# EAGLE design bathroomIndicator (EAGLE 9.6.2)
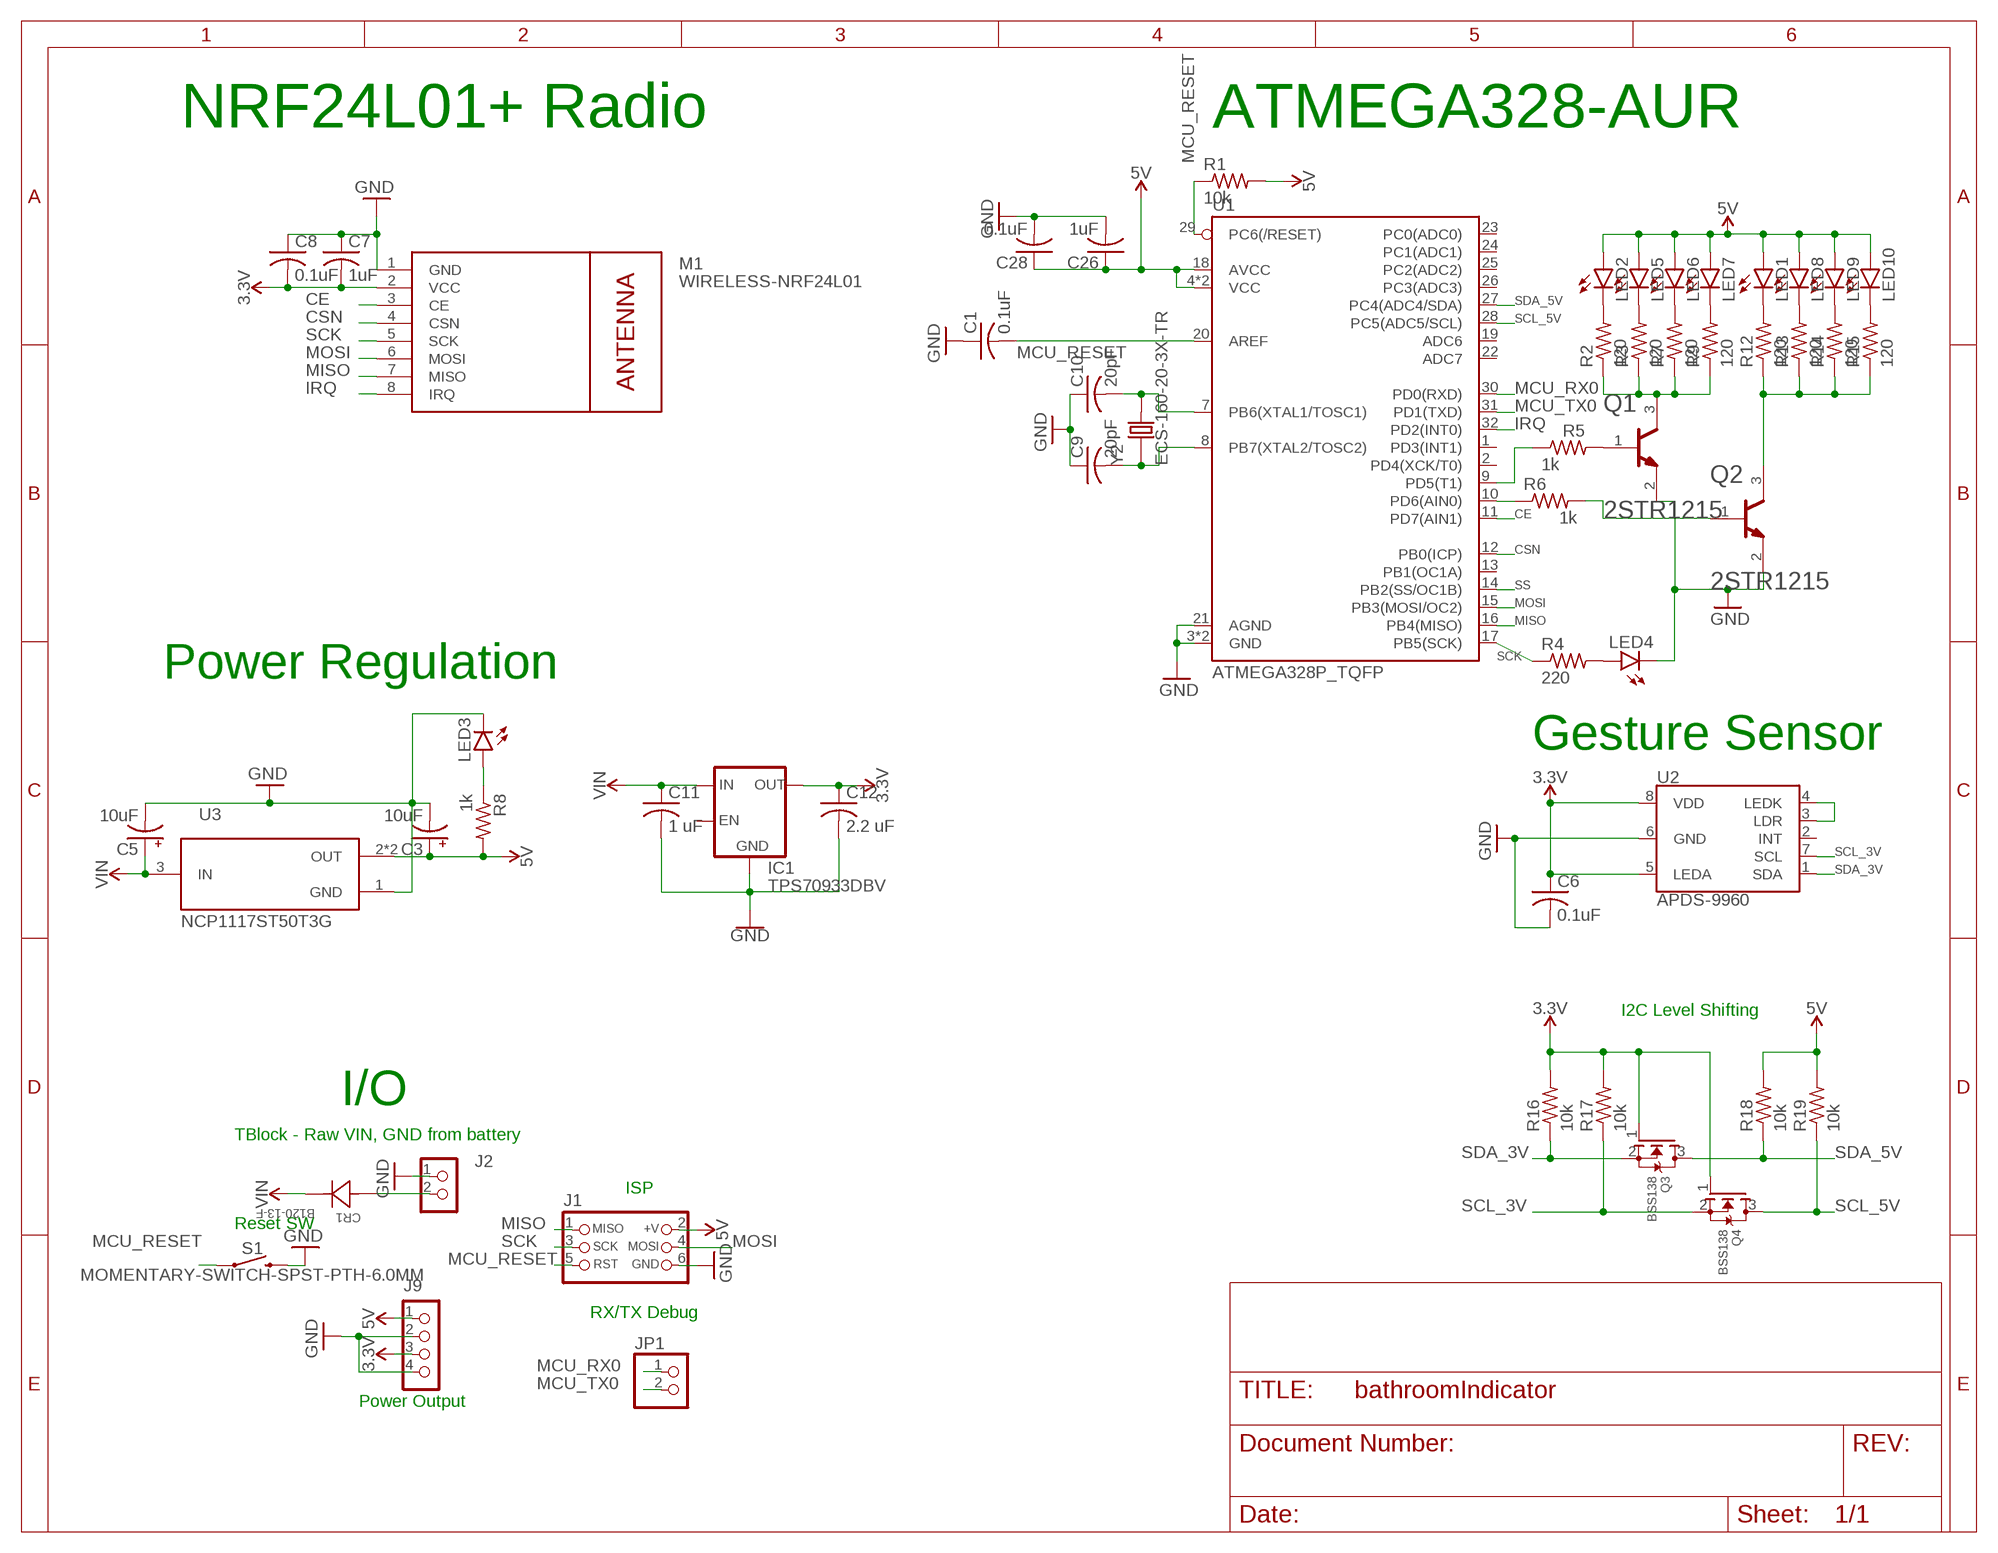
[diagram p0: schematic, sheet 1]

## Parts
C1  0.1uF  C-USC0805  [C0805]
C3  10uF  CPOL-USB/3528-21W  [B/3528-21W]
C5  10uF  CPOL-USB/3528-21W  [B/3528-21W]
C6  0.1uF  C-USC0805  [C0805]
C7  1uF  C-USC0805  [C0805]
C8  0.1uF  C-USC0805  [C0805]
C9  20pF  C-USC0805  [C0805]
C10  20pF  C-USC0805  [C0805]
C11  1 uF  C-USC0805  [C0805]
C12  2.2 uF  C-USC0805  [C0805]
C26  1uF  C-USC0805  [C0805]
C28  0.1uF  C-USC0805  [C0805]
CR1  B120-13-F  [SMA_DIO]
IC1  TPS70933DBV  [SOT23-5]
J1  CON_HEADER_PRG_AVR_ICSP-PTH  [HEADER_PRG_2X03]
J2  CON_TERMINAL_BLOCK_02-5MM  [TERMINAL_BLOCK_2P_5]
J9  CON_HEADER_1X04  [M1X4]
JP1  HEADER-1X2ROUND  [1X02_ROUND]
LED1  LED5MM  [LED5MM]
LED2  LED5MM  [LED5MM]
LED3  LEDSML0805  [SML0805]
LED4  LEDSML0805  [SML0805]
LED5  LED5MM  [LED5MM]
LED6  LED5MM  [LED5MM]
LED7  LED5MM  [LED5MM]
LED8  LED5MM  [LED5MM]
LED9  LED5MM  [LED5MM]
LED10  LED5MM  [LED5MM]
M1  WIRELESS-NRF24L01  [WIRELESS-NRF24L01]
Q1  STMICROELECTRONICS_2STR1215STMICROELECTRONICS_2STR1215_0_0  [STMICROELECTRONICS_2STR1215_0]
Q2  STMICROELECTRONICS_2STR1215STMICROELECTRONICS_2STR1215_0_0  [STMICROELECTRONICS_2STR1215_0]
Q3  BSS138  MOSFET-NWIDE  [SOT23-WIDE]
Q4  BSS138  MOSFET-NWIDE  [SOT23-WIDE]
R1  10k  R-US_R0805  [R0805]
R2  120  R-US_R0805  [R0805]
R3  120  R-US_R0805  [R0805]
R4  220  R-US_R0805  [R0805]
R5  1k  R-US_R0805  [R0805]
R6  1k  R-US_R0805  [R0805]
R7  120  R-US_R0805  [R0805]
R8  1k  R-US_R0805  [R0805]
R9  120  R-US_R0805  [R0805]
R12  120  R-US_R0805  [R0805]
R13  120  R-US_R0805  [R0805]
R14  120  R-US_R0805  [R0805]
R15  120  R-US_R0805  [R0805]
R16  10k  R-US_R0805  [R0805]
R17  10k  R-US_R0805  [R0805]
R18  10k  R-US_R0805  [R0805]
R19  10k  R-US_R0805  [R0805]
S1  MOMENTARY-SWITCH-SPST-PTH-6.0MM  [TACTILE_SWITCH_PTH_6.0MM]
U1  ATMEGA328P_TQFP  [TQFP32-08]
U2  APDS-9960  [APDS-9960]
U3  NCP1117ST50T3G  [SOT230P700X180-4N]
Y2  ECS-160-20-3X-TR  [XTAL_ECS-160-20-3X-TR]

## Nets
3.3V [ICPower]: C6.1 C7.2 C8.2 C12.1 IC1.5(OUT) J9.3 M1.2(VCC) Q3.1(G) Q4.1(G) R16.2 R17.2 U2.5(LEDA) U2.8(VDD)
5V [ICPower]: C3.+ C26.1 C28.1 J1.2(+V) J9.1 LED1.A LED2.A LED5.A LED6.A LED7.A LED8.A LED9.A LED10.A R1.2 R8.2 R18.2 R19.2 U1.4(VCC) U1.6(VCC) U1.18(AVCC) U3.2(OUT) U3.4(OUT)
CE: M1.3(CE) U1.11(PD7(AIN1))
CSN: M1.4(CSN) U1.12(PB0(ICP))
GND [ICPower]: C1.1 C3.- C5.- C6.2 C7.1 C8.1 C9.1 C10.1 C11.2 C12.2 C26.2 C28.2 IC1.2(GND) J1.6(GND) J2.1 J9.2 J9.4 LED3.C LED4.C M1.1(GND) Q1.2(E) Q2.2(E) S1.3 U1.3(GND) U1.5(GND) U1.21(AGND) U2.6(GND) U3.1(GND)
IRQ: M1.8(IRQ) U1.32(PD2(INT0))
MCU_RESET: J1.5(RST) R1.1 S1.1 U1.29(PC6(/RESET))
MCU_RX0: JP1.1 U1.30(PD0(RXD))
MCU_TX0: JP1.2 U1.31(PD1(TXD))
MISO: J1.1(MISO) M1.7(MISO) U1.16(PB4(MISO))
MOSI: J1.4(MOSI) M1.6(MOSI) U1.15(PB3(MOSI/OC2))
N$2 [ICPower]: LED2.K(C) R2.2
N$3 [ICPower]: LED5.K(C) R3.2
N$4: C1.2 U1.20(AREF)
N$5 [ICPower]: LED6.K(C) R7.2
N$6: R5.1 U1.9(PD5(T1))
N$7 [ICPower]: LED7.K(C) R9.2
N$8: LED4.A R4.2
N$10: Q2.1(B) R6.2
N$11: R6.1 U1.10(PD6(AIN0))
N$12: LED3.A R8.1
N$13: Q1.1(B) R5.2
N$14: C9.2 U1.8(PB7(XTAL2/TOSC2)) Y2.1
N$15: C10.2 U1.7(PB6(XTAL1/TOSC1)) Y2.2
N$24: U2.3(LDR) U2.4(LEDK)
N$26 [ICPower]: LED1.K(C) R12.2
N$27 [ICPower]: LED8.K(C) R13.2
N$28 [ICPower]: LED9.K(C) R14.2
N$29 [ICPower]: LED10.K(C) R15.2
N$30 [ICPower]: Q1.3(C) R2.1 R3.1 R7.1 R9.1
N$31 [ICPower]: Q2.3(C) R12.1 R13.1 R14.1 R15.1
N$33 [HighPower]: CR1.2 J2.2
SCK: J1.3(SCK) M1.5(SCK) R4.1 U1.17(PB5(SCK))
SCL_3V: Q4.2(S) R17.1 U2.7(SCL)
SCL_5V: Q4.3(D) R19.1 U1.28(PC5(ADC5/SCL))
SDA_3V: Q3.2(S) R16.1 U2.1(SDA)
SDA_5V: Q3.3(D) R18.1 U1.27(PC4(ADC4/SDA))
SS: U1.14(PB2(SS/OC1B))
VIN [ICPower]: C5.+ C11.1 CR1.1 IC1.1(IN) U3.3(IN)
Unconnected: IC1.3(EN) U1.1(PD3(INT1)) U1.2(PD4(XCK/T0)) U1.13(PB1(OC1A)) U1.19(ADC6) U1.22(ADC7) U1.23(PC0(ADC0)) U1.24(PC1(ADC1)) U1.25(PC2(ADC2)) U1.26(PC3(ADC3)) U2.2(INT)

## Notes on the sheet
- NRF24L01+ Radio | ATMEGA328-AUR
- Power Regulation
- Gesture Sensor
- I2C Level Shifting
- I/O
- TBlock - Raw VIN, GND from battery
- ISP
- Reset SW
- RX/TX Debug
- Power Output

## Library data of the parts
C1 C6-C12 C26 C28 = rcl:C-US: CAPACITOR, American symbol; SPICEPREFIX: C
C3 C5 = rcl:CPOL-US: POLARIZED CAPACITOR, American symbol; SPICEPREFIX: C
CR1 = B120-13-F:B120-13-F; BUILT_BY: EMA_UL_Team; MANUFACTURER_PART_NUMBER: B120-13-F; SOURCELIBRARY: DiodesInc_2015-05-08; VENDOR: Diodes Inc
IC1 = tps709xx_10:TPS709*: TPS709xx 150-mA, 30-V, 1-μA IQ Voltage Regulators with Enable Source: http://www.ti.com/lit/ds/symlink/tps709.pdf; MF: Texas Instruments; MPN: TPS70933DBVT; OC_FARNELL: 2382995; OC_NEWARK: 37X8895
J1 = dp_devices.v6:CON_HEADER_PRG_AVR_ICSP: 2x3 AVR ICSP programming header
J2 = dp_devices.v6:CON_TERMINAL_BLOCK_02: 2 poles wire to board terminal block
J9 = dp_devices.v6:CON_HEADER_1X04
JP1 = microbuilder:HEADER-1X2: PIN HEADER
LED1-LED10 = led:LED: LED OSRAM: - CHIPLED LG R971, LG N971, LY N971, LG Q971, LY Q971, LO R971, LY R971 LH N974, LH R974 LS Q976, LO Q976, LY Q976 LO Q996 - Hyper CHIPLED LW Q18S LB Q993, LB Q99A, LB R99A - SideLED LS A670, LO A670, LY A670, LG A670, LP A670 LB A673, LV A673, LT A673, LW A673 LH A674 LY A675 LS A676, LA A676, LO A676, LY A676, LW A676 LS A679, LY A679, LG A679 - Hyper Micro SIDELED® LS Y876, LA Y876, LO Y876, LY Y876 LT Y87S - SmartLED LW L88C, LW L88S LB L89C, LB L89S, LG L890 LS L89K, LO L89K, LY L89K LS L896, LA L896, LO L896, LY L896 - TOPLED LS T670, LO T670, LY T670, LG T670, LP T670 LSG T670, LSP T670, LSY T670, LOP T670, LYG T670 LG T671, LOG T671, LSG T671 LB T673, LV T673, LT T673, LW T673 LH T674 LS T676, LA T676, LO T676, LY T676, LB T676, LH T676, LSB T676, LW T676 LB T67C, LV T67C, LT T67C, LS T67K, LO T67K, LY T67K, LW E67C LS E67B, LA E67B, LO E67B, LY E67B, LB E67C, LV E67C, LT E67C LW T67C LS T679, LY T679, LG T679 LS T770, LO T770, LY T770, LG T770, LP T770 LB T773, LV T773, LT T773, LW T773 LH T774 LS E675, LA E675, LY E675, LS T675 LS T776, LA T776, LO T776, LY T776, LB T776 LHGB T686 LT T68C, LB T68C - Hyper Mini TOPLED® LB M676 - Mini TOPLED Santana® LG M470 LS M47K, LO M47K, LY M47K Source: http://www.osram.convergy.de LUXEON: - LUMILED® LXK2-PW12-R00, LXK2-PW12-S00, LXK2-PW14-U00, LXK2-PW14-V00 LXK2-PM12-R00, LXK2-PM12-S00, LXK2-PM14-U00 LXK2-PE12-Q00, LXK2-PE12-R00, LXK2-PE12-S00, LXK2-PE14-T00, LXK2-PE14-U00 LXK2-PB12-K00, LXK2-PB12-L00, LXK2-PB12-M00, LXK2-PB14-N00, LXK2-PB14-P00, LXK2-PB14-Q00 LXK2-PR12-L00, LXK2-PR12-M00, LXK2-PR14-Q00, LXK2-PR14-R00 LXK2-PD12-Q00, LXK2-PD12-R00, LXK2-PD12-S00 LXK2-PH12-R00, LXK2-PH12-S00 LXK2-PL12-P00, LXK2-PL12-Q00, LXK2-PL12-R00 Source: www.luxeon.com KINGBRIGHT: KA-3528ASYC Source: www.kingbright.com
M1 = diy-modules:WIRELESS-NRF24L01: 2.4 GHz Wireless Module based on NRF24L01 chip More details available here: http://www.electrodragon.com/w/NRF24L01 Click here to find device on ebay.com <http://www.ebay.com/sch/nrf24l01+arduino>
Q1 Q2 = STMicroelectronics - 2STR1215:STMICROELECTRONICS_2STR1215: Bipolar (BJT) Transistor NPN 15V 1.5A 500mW Surface Mount SOT-23-3; AUTOMOTIVE: No; CENTROID_NOT_SPECIFIED: No; COLLECTOR_BASE_VOLTAGE: 15V; COLLECTOR_EMITTER_BREAKDOWN_VOLTAGE: 15V; COLLECTOR_EMITTER_SATURATION_VOLTAGE: 0.4V; COLLECTOR_EMITTER_VOLTAGE: 15V; DATASHEET: https://www.st.com/resource/en/datasheet/2str1215.pdf; DEVICE_CLASS_L1: Discrete Semiconductors; DEVICE_CLASS_L2: Transistors; DEVICE_CLASS_L3: BJTs; DIGIKEY_DESCRIPTION: TRANS NPN 15V 1.5A SOT-23; DIGIKEY_PART_NUMBER: 497-6205-1-ND; EMITTER_BASE_VOLTAGE: 5V; FOOTPRINT_PARAMETERS_1: {"fp_type":"SOT23","params":{"N":{"default":"3","long name":"Number of leads","type":"multichoice","short name":"N"},"A":{"nom":false,"long name":"Height","min":false,"max":1250000,"short name":"A","type":"measurement"},"A1":{"nom":75000,"long name":"Package clearance","min":0,"max":150000,"short name":"A1","type":"measurement"},"A2":{"nom":1100000,"long name":"Package height","min":1000000,"max":1200000,"short name":"A2","type":"measurement"},"D":{"nom":2926000,"long name":"Package length","min":2826000,"max":3026000,"short name":"D","type":"measurement"},"E":{"nom":2800000,"long name":"Width /w leads","min":2600000,"max":3000000,"short name":"E","type":"measurement"},"E1":{"nom":1625000,"long name":"Package width","min":1526000,"max":1726000,"short name":"E1","type":"measurement"},"B":{"nom":430000,"long name":"Lead width","min":360000,"max":500000,"short name":"B","type":"measurement"},"C":{"nom":170000,"long name":"Lead thickness","min":140000,"max":200000,"short name":"C","type":"measurement"},"L":{"nom":450000,"long name":"Lead foot length","min":350000,"max":600000,"short name":"L","type":"measurement"},"e":{"nom":950000,"long name":"Lead pitch","min":null,"max":null,"short name":"e","type":"measurement"},"PHI":{"nom":false,"long name":"Lead angle","min":0,"max":8000000,"short name":"PHI","type":"measurement"},"offset x":{"nom":0,"long name":"X Center offset","min":null,"max":null,"short name":"offset x","type":"measurement"},"offset y":{"nom":0,"long name":"Y Center offset","min":null,"max":null,"short name":"offset y","type":"measurement"},"LS":{"default":"Rounded rectangle","long name":"Land shape","type":"multichoice","short name":"LS"},"LS1":{"default":"Rectangle","long name":"Land shape (Pin 1)","type":"multichoice","short name":"LS1"},"solder toe":{"nom":550000,"long name":"Solder fillet (toe)","min":null,"max":null,"short name":"solder toe","type":"fixedmeasurement"},"solder heel":{"nom":450000,"long name":"Solder fillet (heel)","min":null,"max":null,"short name":"solder heel","type":"fixedmeasurement"},"solder side":{"nom":50000,"long name":"Solder fillet (side)","min":null,"max":null,"short name":"solder side","type":"fixedmeasurement"},"courtyard":{"nom":500000,"long name":"Courtyard","min":null,"max":null,"short name":"courtyard","type":"fixedmeasurement"},"SF":{"default":"A","long name":"Packing level","type":"multichoiceparent","short name":"SF","help":"http://support.upverter.com/customer/portal/articles/978783-what-is-a-footprint-packing-level","children":["solder toe","solder heel","solder side","courtyard"]}}}; FOOTPRINT_PARAMETERS_2: {"fp_type":"SOT23","params":{"N":{"default":"3","long name":"Number of leads","type":"multichoice","short name":"N"},"A":{"nom":false,"long name":"Height","min":false,"max":1250000,"short name":"A","type":"measurement"},"A1":{"nom":75000,"long name":"Package clearance","min":0,"max":150000,"short name":"A1","type":"measurement"},"A2":{"nom":1100000,"long name":"Package height","min":1000000,"max":1200000,"short name":"A2","type":"measurement"},"D":{"nom":2926000,"long name":"Package length","min":2826000,"max":3026000,"short name":"D","type":"measurement"},"E":{"nom":2800000,"long name":"Width /w leads","min":2600000,"max":3000000,"short name":"E","type":"measurement"},"E1":{"nom":1625000,"long name":"Package width","min":1526000,"max":1726000,"short name":"E1","type":"measurement"},"B":{"nom":430000,"long name":"Lead width","min":360000,"max":500000,"short name":"B","type":"measurement"},"C":{"nom":170000,"long name":"Lead thickness","min":140000,"max":200000,"short name":"C","type":"measurement"},"L":{"nom":450000,"long name":"Lead foot length","min":350000,"max":600000,"short name":"L","type":"measurement"},"e":{"nom":950000,"long name":"Lead pitch","min":null,"max":null,"short name":"e","type":"measurement"},"PHI":{"nom":false,"long name":"Lead angle","min":0,"max":8000000,"short name":"PHI","type":"measurement"},"offset x":{"nom":0,"long name":"X Center offset","min":null,"max":null,"short name":"offset x","type":"measurement"},"offset y":{"nom":0,"long name":"Y Center offset","min":null,"max":null,"short name":"offset y","type":"measurement"},"LS":{"default":"Rounded rectangle","long name":"Land shape","type":"multichoice","short name":"LS"},"LS1":{"default":"Rectangle","long name":"Land shape (Pin 1)","type":"multichoice","short name":"LS1"},"solder toe":{"nom":350000,"long name":"Solder fillet (toe)","min":null,"max":null,"short name":"solder toe","type":"fixedmeasurement"},"solder heel":{"nom":350000,"long name":"Solder fillet (heel)","min":null,"max":null,"short name":"solder heel","type":"fixedmeasurement"},"solder side":{"nom":30000,"long name":"Solder fillet (side)","min":null,"max":null,"short name":"solder side","type":"fixedmeasurement"},"courtyard":{"nom":250000,"long name":"Courtyard","min":null,"max":null,"short name":"courtyard","type":"fixedmeasurement"},"SF":{"default":"B","long name":"Packing level","type":"multichoiceparent","short name":"SF","help":"http://support.upverter.com/customer/portal/articles/978783-what-is-a-footprint-packing-level","children":["solder toe","solder heel","solder side","courtyard"]}}}; FOOTPRINT_PARAMETERS_3: {"fp_type":"SOT23","params":{"N":{"default":"3","long name":"Number of leads","type":"multichoice","short name":"N"},"A":{"nom":false,"long name":"Height","min":false,"max":1250000,"short name":"A","type":"measurement"},"A1":{"nom":75000,"long name":"Package clearance","min":0,"max":150000,"short name":"A1","type":"measurement"},"A2":{"nom":1100000,"long name":"Package height","min":1000000,"max":1200000,"short name":"A2","type":"measurement"},"D":{"nom":2926000,"long name":"Package length","min":2826000,"max":3026000,"short name":"D","type":"measurement"},"E":{"nom":2800000,"long name":"Width /w leads","min":2600000,"max":3000000,"short name":"E","type":"measurement"},"E1":{"nom":1625000,"long name":"Package width","min":1526000,"max":1726000,"short name":"E1","type":"measurement"},"B":{"nom":430000,"long name":"Lead width","min":360000,"max":500000,"short name":"B","type":"measurement"},"C":{"nom":170000,"long name":"Lead thickness","min":140000,"max":200000,"short name":"C","type":"measurement"},"L":{"nom":450000,"long name":"Lead foot length","min":350000,"max":600000,"short name":"L","type":"measurement"},"e":{"nom":950000,"long name":"Lead pitch","min":null,"max":null,"short name":"e","type":"measurement"},"PHI":{"nom":false,"long name":"Lead angle","min":0,"max":8000000,"short name":"PHI","type":"measurement"},"offset x":{"nom":0,"long name":"X Center offset","min":null,"max":null,"short name":"offset x","type":"measurement"},"offset y":{"nom":0,"long name":"Y Center offset","min":null,"max":null,"short name":"offset y","type":"measurement"},"LS":{"default":"Rounded rectangle","long name":"Land shape","type":"multichoice","short name":"LS"},"LS1":{"default":"Rectangle","long name":"Land shape (Pin 1)","type":"multichoice","short name":"LS1"},"solder toe":{"nom":150000,"long name":"Solder fillet (toe)","min":null,"max":null,"short name":"solder toe","type":"fixedmeasurement"},"solder heel":{"nom":250000,"long name":"Solder fillet (heel)","min":null,"max":null,"short name":"solder heel","type":"fixedmeasurement"},"solder side":{"nom":10000,"long name":"Solder fillet (side)","min":null,"max":null,"short name":"solder side","type":"fixedmeasurement"},"courtyard":{"nom":100000,"long name":"Courtyard","min":null,"max":null,"short name":"courtyard","type":"fixedmeasurement"},"SF":{"default":"C","long name":"Packing level","type":"multichoiceparent","short name":"SF","help":"http://support.upverter.com/customer/portal/articles/978783-what-is-a-footprint-packing-level","children":["solder toe","solder heel","solder side","courtyard"]}}}; FOOTPRINT_VARIANT_NAME_0: Recommended_Land_Pattern; FOOTPRINT_VARIANT_NAME_1: IPC_A; FOOTPRINT_VARIANT_NAME_2: IPC_B; FOOTPRINT_VARIANT_NAME_3: IPC_C; HEIGHT: 1.25mm; HFE_MAX: 560; HFE_MIN: 200; HFE_TESTIC: 0.5A; HFE_TESTVCE: 2V; IPC_LAND_PATTERN_NAME: SOT95P280X125-3; LEAD_FREE: Yes; MAX_COLLECTOR_CURRENT: 1.5A; MAX_JUNCTION_TEMP: +150°C; MF: STMicroelectronics; MFG_PACKAGE_IDENT: SOT23_8162275; MFG_PACKAGE_IDENT_COMPONENT_ID: 8e1c602943959e66; MFG_PACKAGE_IDENT_DATE: 0; MFG_PACKAGE_IDENT_REV: 3; MOUSER_DESCRIPTION: Bipolar Transistors - BJT Lo Vltg FAST SWITCH Hi GAIN PNP; MOUSER_PART_NUMBER: 511-2STR1215; MPN: 2STR1215; NUMBER_OF_ELEMENTS: 1; NUMBER_OF_NPN: 1; PACKAGE: SOT-23; POWER_DISSIPATION: 0.5W; PREFIX: Q; ROHS: Yes; RTHJA_MAX: 250°C/W; STANDOFF_HEIGHT: 0mm; TEMPERATURE_RANGE_HIGH: +150°C; TEMPERATURE_RANGE_LOW: -65°C; VERIFICATION_VERSION: 0.0.0.3; VOLTAGE: 15V
Q3 Q4 = microbuilder:MOSFET-N: N-Channel Mosfet LEGEND VDS: Voltage Drain-Source ID: Drain Current RDS(ON): Drain-Source On-State Resistance VGS(TH): Gate-Source Threshold Voltage CISS: Drain-Source Input Capacitance SOT-23 Name VDS ID RDS(ON) VGS(TH) CISS Order Number 2N7002E 60V 260mA 2.5 Ohm 2.5V @ 250uA 26.7pF @ 25V 2N7002ET1GOSTR-ND BSH103 30V 850mA 400 mOhm 400mV @ 1mA 83pF @ 24V BSH103,235-ND BSS138 60V 320mA 1.6 Ohm 1.5V @ 250uA 50pF @ 10V Mouser: 771-BSS138PW115 DMN2075U-7 20V 4.2A 38 mOhm 1V @ 250 uA 594.3pF @ 10V DMN2075U-7DICT-ND * BSS138 good choice for I2C level-shifting
R1-R9 R12-R19 = rcl:R-US_: RESISTOR, American symbol; SPICEPREFIX: R
S1 = SparkFun-Switches:MOMENTARY-SWITCH-SPST: Momentary Switch (Pushbutton) - SPST Normally-open (NO) SPST momentary switches (buttons, pushbuttons). Variants PTH-12MM - 12mm square, through-hole Momentary Pushbutton Switch - 12mm Square <https://www.sparkfun.com/products/9190> (COM-09190) PTH-6.0MM, PTH-6.0MM-KIT - 6.0mm square, through-hole Mini Pushbutton Switch <https://www.sparkfun.com/products/97> (COM-00097) KIT package intended for soldering kit's - only one side of pads' copper is exposed. PTH-RIGHT-ANGLE-KIT - Right-angle, through-hole Right Angle Tactile Button <https://www.sparkfun.com/products/10791> - Used on SparkFun BigTime Watch Kit <https://www.sparkfun.com/products/11734> SMD-12MM - 12mm square, surface-mount Tactile Button - SMD (12mm) <https://www.sparkfun.com/products/12993> (COM-12993) Used on SparkFun PicoBoard <https://www.sparkfun.com/products/11888> SMD-4.5MM - 4.5mm Square Trackball Switch Used on SparkFun Blackberry Trackballer Breakout <https://www.sparkfun.com/products/13169> SMD-4.6MMX2.8MM - 4.60mm x 2.80mm, surface mount Used on SparkFun SAMD21 Mini Breakout <https://www.sparkfun.com/products/13664> SMD-5.2MM, SMD-5.2-REDUNDANT - 5.2mm square, surface-mount Mini Pushbutton Switch - SMD <https://www.sparkfun.com/products/8720> (COM-08720) Used on Arduino Pro Mini <https://www.sparkfun.com/products/11114> REDUNDANT package connects both switch circuits together SMD-6.0X3.5MM - 6.0 x 3.5mm, surface mount Momentary Reset Switch SMD <https://www.sparkfun.com/products/8229> (COM-08229) SMD-6.2MM-TALL - 6.2mm square, surface mount Tactile Button - SMD (6mm) <https://www.sparkfun.com/products/12992> Used on SparkFun Digital Sandbox <https://www.sparkfun.com/products/12651> SMD-RIGHT-ANGLE - Right-angle, surface mount Used on SparkFun Block for Intel® Edison - Arduino <https://www.sparkfun.com/products/13036>; PROD_ID: SWCH-08441; SF_SKU: COM-00097
U1 = SparkFun-IC-Microcontroller:ATMEGA328P_TQFP: Popular 328P in QFP Storefront component: ATmega328 - TQFP <https://www.sparkfun.com/products/13448> (COM-13448) Datasheet <http://www.sparkfun.com/datasheets/Components/SMD/ATMega328.pdf> SparkFun Products SparkFun RedBoard - Programmed with Arduino <https://www.sparkfun.com/products/12757> (DEV-12757) Arduino Pro Mini 328 - 5V/16MHz <https://www.sparkfun.com/products/11113> (DEV-11113) Arduino Pro Mini 328 - 3.3V/8MHz <https://www.sparkfun.com/products/11114> (DEV-11114) SparkFun OpenLog <https://www.sparkfun.com/products/13712> (DEV-13712) SparkFun MicroView - OLED Arduino Module <https://www.sparkfun.com/products/12923> (DEV-12923) SparkFun Digital Sandbox <https://www.sparkfun.com/products/12651> (DEV-12651) SparkFun PicoBoard <https://www.sparkfun.com/products/11888> (WIG-11888) Arduino Fio <https://www.sparkfun.com/products/10116> (DEV-10116) LilyPad Arduino 328 Main Board <https://www.sparkfun.com/products/13342> (DEV-13342) SparkFun RedStick <https://www.sparkfun.com/products/13741> (DEV-13741) LilyPad MP3 <https://www.sparkfun.com/products/11013> (DEV-11013) LilyPad Arduino SimpleSnap <https://www.sparkfun.com/products/10941> (DEV-10941) SparkFun Stepoko <https://www.sparkfun.com/products/13899> (ROB-13899) SparkFun Geiger Counter <https://www.sparkfun.com/products/11345> (SEN-11345) SparkFun EL Sequencer <https://www.sparkfun.com/products/12781> (COM-12781) Arduino Pro 328 - 5V/16MHz <https://www.sparkfun.com/products/10915> (DEV-10915) CryptoCape <https://www.sparkfun.com/products/12773> (DEV-12773) SparkFun IR Thermometer Evaluation Board - MLX90614 <https://www.sparkfun.com/products/10740> (SEN-10740) SparkFun RedBot Mainboard <https://www.sparkfun.com/products/12097> (ROB-12097) Arduino Pro 328 - 3.3V/8MHz <https://www.sparkfun.com/products/10914> (DEV-10914) SparkFun Block for Intel® Edison - Arduino <https://www.sparkfun.com/products/13036> (DEV-13036) SparkFun Simon Says - Surface Mount Soldering Kit <https://www.sparkfun.com/products/10935> (KIT-10935) SparkFun 7-Segment Serial Display - Red <https://www.sparkfun.com/products/11441> (COM-11441) SparkFun 7-Segment Serial Display - White <https://www.sparkfun.com/products/11629> (COM-11629) SparkFun 7-Segment Serial Display - Yellow <https://www.sparkfun.com/products/11443> (COM-11443) SparkFun 7-Segment Serial Display - Kelly Green <https://www.sparkfun.com/products/11440> (COM-11440) SparkFun 7-Segment Serial Display - Blue <https://www.sparkfun.com/products/11442> (COM-11442) SparkFun OpenSegment Serial Display - 20mm (Blue) <https://www.sparkfun.com/products/11647> (COM-11647) SparkFun OpenSegment Serial Display - 20mm (Green) <https://www.sparkfun.com/products/11646> (COM-11646) SparkFun OpenSegment Serial Display - 20mm (White) <https://www.sparkfun.com/products/11648> (COM-11648) SparkFun OpenSegment Serial Display - 20mm (Red) <https://www.sparkfun.com/products/11644> (COM-11644) SparkFun OpenSegment Serial Display - 20mm (Yellow) <https://www.sparkfun.com/products/11645> (COM-11645) SparkFun OpenSegment Shield <https://www.sparkfun.com/products/13190> (DEV-13190); PROD_ID: IC-09069
U2 = SparkFun-Sensors:APDS-9960: Avago APDS-9960 Digital Proximity, Ambient Light, RGB, and Gesture Sensor. The APDS-9960 offers ambient light and color measuring, proximity detection, and touchless gesture sensing. It features UV and IR blocking filters, four separate diodes sensitive to different directions, and an I2C compatible interface. Datasheet <https://cdn.sparkfun.com/datasheets/Sensors/Proximity/apds9960.pdf> SparkFun Products SparkFun RGB and Gesture Sensor - APDS-9960 <https://www.sparkfun.com/products/12787> (SEN-12787); PROD_ID: SEN-12005
U3 = NCP1117ST50T3G:NCP1117ST50T3G: 1.0 A Low-Dropout Positive ,Fixed and Adjustable,Voltage Regulators; AVAILABILITY: Unavailable; DESCRIPTION: Linear Voltage Regulator IC 1 Output 1A SOT-223; DIGIKEY-PURCHASE-URL: https://snapeda.com/shop?store=DigiKey&id=836318; MF: ON Semiconductor; MOUSER-PURCHASE-URL: https://snapeda.com/shop?store=Mouser&id=836318; MP: NCP1117ST50T3G; PACKAGE: SOT-223 ON Semiconductor; PRICE: None
Y2 = ECS-160-20-3X-TR:ECS-160-20-3X-TR: SMD QUARTZ CRYSTAL; ARROW_ELECTRONICS-PURCHASE-URL: https://snapeda.com/shop?store=Arrow+Electronics&id=561589; AVAILABILITY: Unavailable; DESCRIPTION: 16MHz ±30ppm Crystal 20pF 50 Ohms HC-49/US; DIGIKEY-PURCHASE-URL: https://snapeda.com/shop?store=DigiKey&id=561589; MF: ECS Inc.; MOUSER-PURCHASE-URL: https://snapeda.com/shop?store=Mouser&id=561589; MP: ECS-160-20-3X-TR; PACKAGE: HC49/US ECS International; PRICE: None

## Net classes
1 ICPower: width 0.483 mm
2 HighPower: width 0.762 mm

## Board
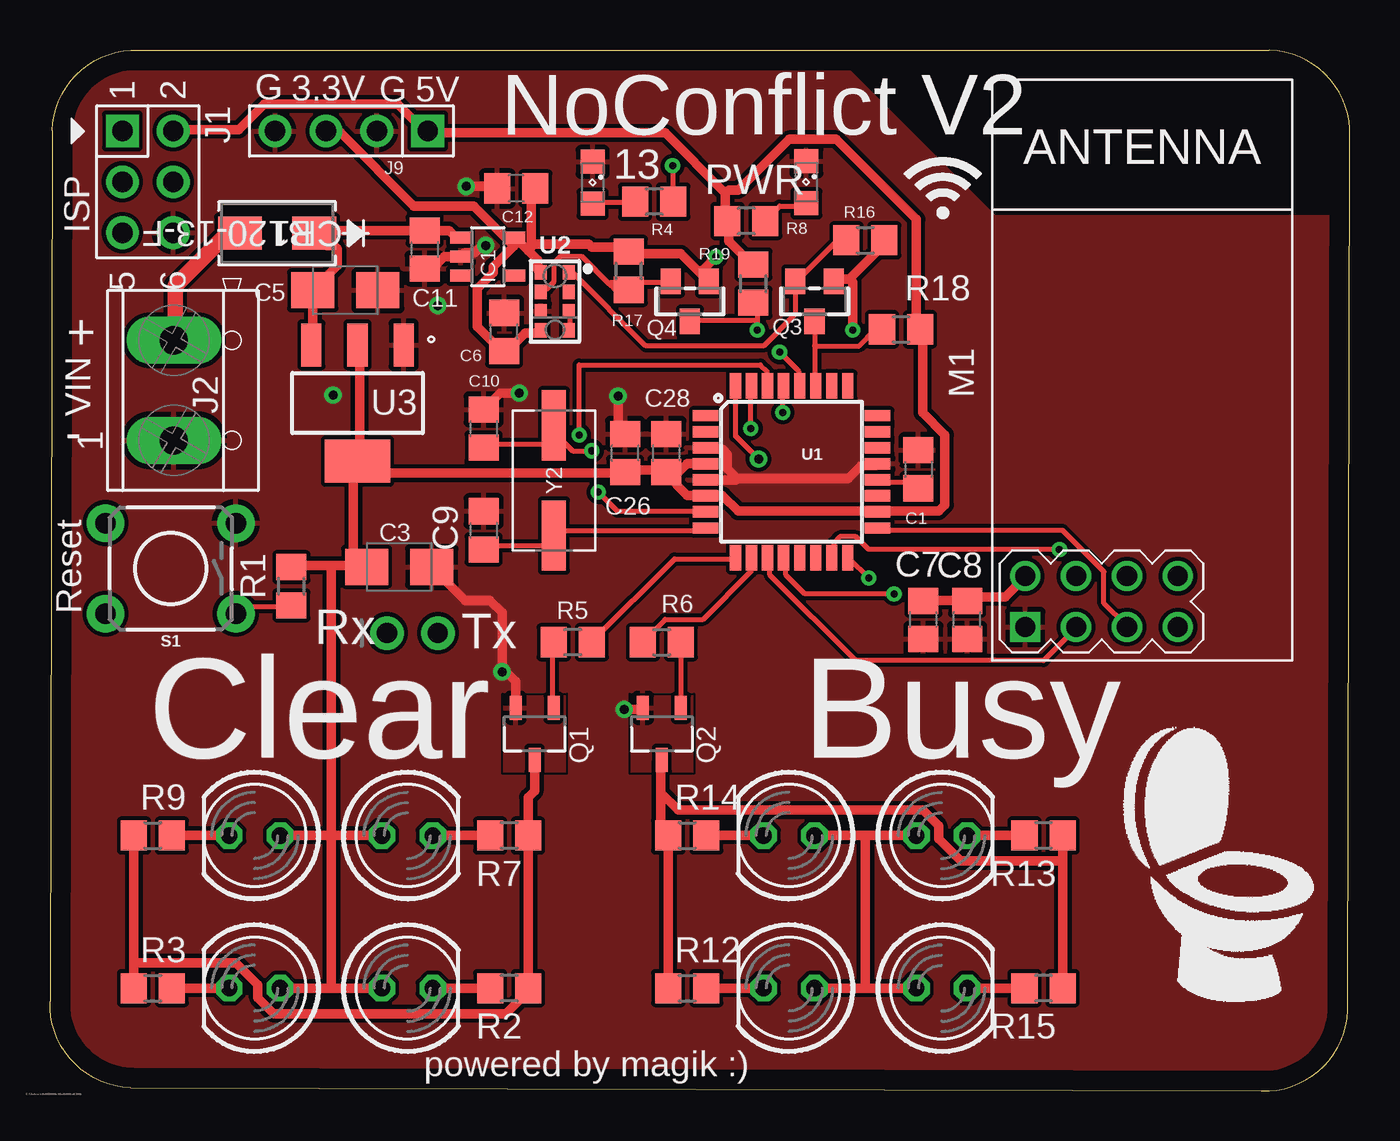
[diagram p1: board, top side]
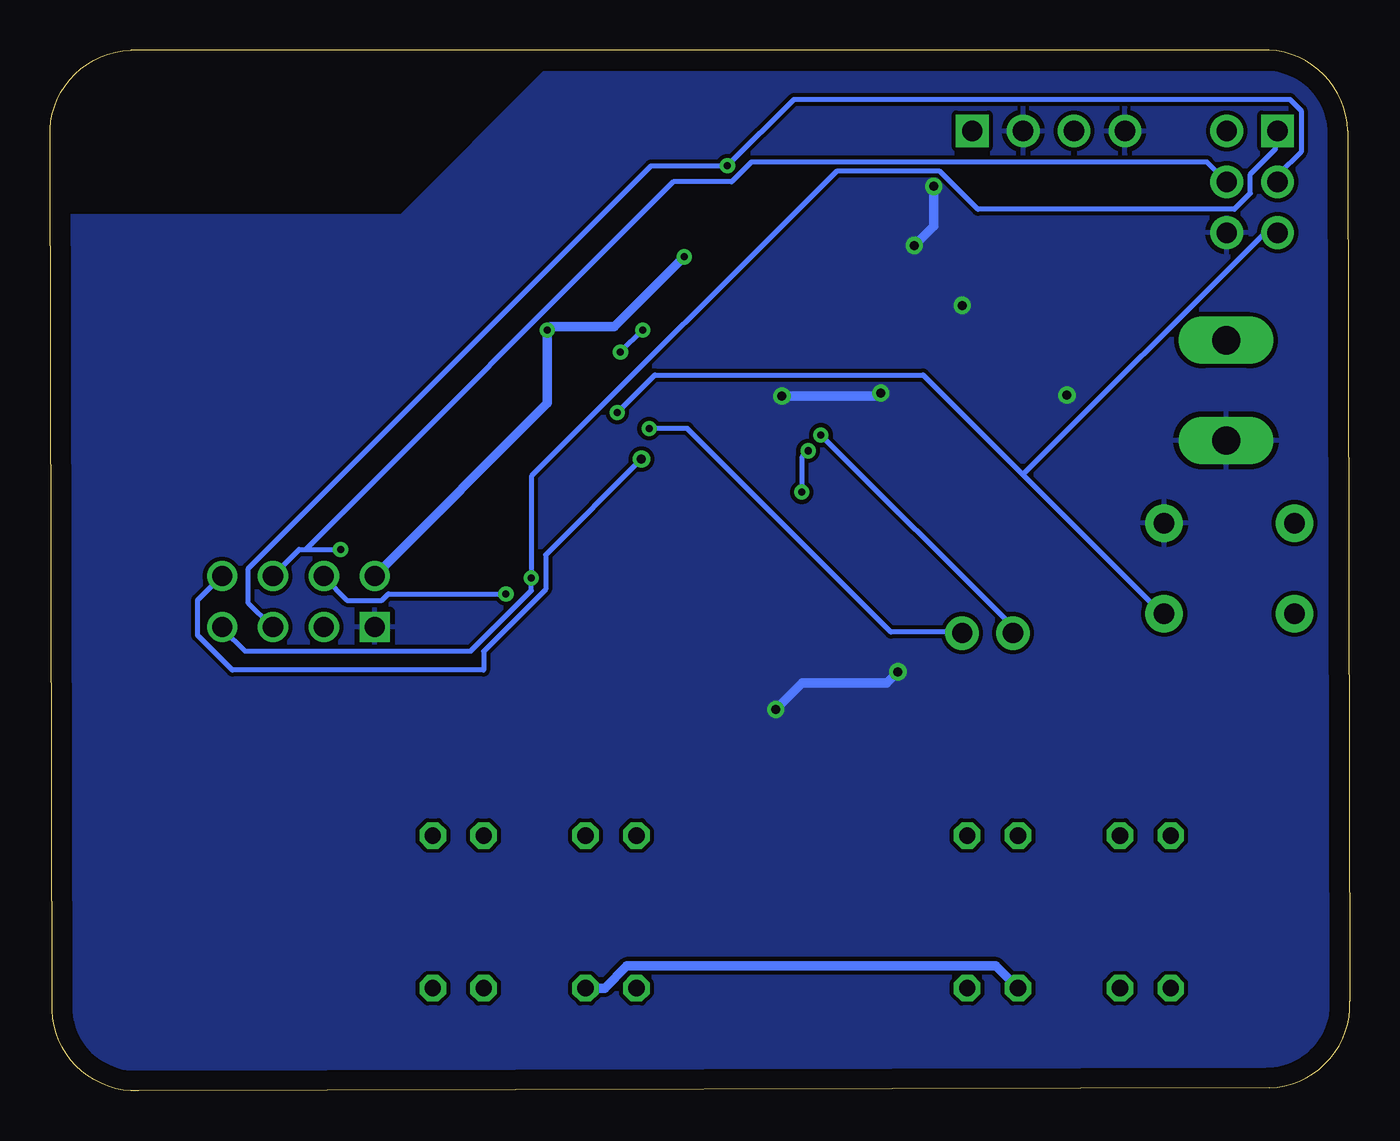
[diagram p2: board, bottom side, seen from below]

Size 64.87 x 51.97 mm. Coordinates in mm from the lower left corner, seen from the top.
Outline: 0.1,47.95 arc-90 4.42,51.97 60.86,51.97 arc-90 64.87,47.65 64.77,4.01 arc-90 60.45,0 4.01,0.15 arc-90 0,4.47 0.1,47.95
Copper layers (1*16): Top 0.035mm / dielectric 1.5mm / Bottom 0.035mm
Design rules "default *": minimum track width 10mil, minimum drill 0.35mm, track to track 8mil, track to pad 8mil, pad to pad 8mil, via to via 8mil, smd to smd 6mil, copper to edge 40mil, drill to drill 6mil, minimum pad ring 10mil, minimum via ring 8mil, stop-mask expansion 4mil, vias tented up to drill 0mil, thermal gap 10mil

### Footprints (pad centres in the part's own frame; a part is rotated, then mirrored left to right if it is on the bottom)
C0805 = smd 1.3 x 1.5: 1 -0.95,0; 2 0.95,0
B/3528-21W = smd 2.15 x 1.8: + 1.625,0; - -1.625,0
SMA_DIO = smd 2.18 x 1.63: 1 -1.857,0; 2 1.857,0
SOT23-5 = smd 0.6 x 1.05: 1 -0.95,-1.35; 2 0,-1.35; 3 0.95,-1.35; 4 0.95,1.35; 5 -0.95,1.35
HEADER_PRG_2X03 = drill 1.02 pad 1.632 square: 1 -2.54,-1.27 | drill 1.02 pad 1.632: 2 -2.54,1.27; 3 0,-1.27; 4 0,1.27; 5 2.54,-1.27; 6 2.54,1.27
TERMINAL_BLOCK_2P_5 = drill 1.4 pad 2.38 long: 1 2.5,-0.45; 2 -2.5,-0.45
M1X4 = drill 1.02 pad 1.632 square: 1 0,0 | drill 1.02 pad 1.632: 2 2.54,0; 3 5.08,0; 4 7.62,0
1X02_ROUND = drill 1 pad 1.676: 1 -1.27,0; 2 1.27,0
LED5MM = drill 0.813 octagon: A -1.27,0; K 1.27,0
SML0805 = smd 1.2 x 1.2: A 1.05,0; C -1.05,0
WIRELESS-NRF24L01 = drill 1 square: 1 -12.7,6.35 | drill 1: 2 -10.16,6.35; 3 -12.7,3.81; 4 -10.16,3.81; 5 -12.7,1.27; 6 -10.16,1.27; 7 -12.7,-1.27; 8 -10.16,-1.27
STMICROELECTRONICS_2STR1215_0 = smd 1.2 x 0.6: 1 -1.3,0.95; 2 -1.3,-0.95; 3 1.3,0
SOT23-WIDE = smd 1 x 1.27: 1 -0.95,-1; 2 0.95,-1; 3 0,1
R0805 = smd 1.3 x 1.5: 1 -0.95,0; 2 0.95,0
TACTILE_SWITCH_PTH_6.0MM = drill 1.016 pad 1.88: 1 -3.251,2.261; 2 3.251,2.261; 3 -3.251,-2.261; 4 3.251,-2.261
TQFP32-08 = smd 1.27 x 0.559: 1 -4.293,2.8; 2 -4.293,2; 3 -4.293,1.2; 4 -4.293,0.4; 5 -4.293,-0.4; 6 -4.293,-1.2; 7 -4.293,-2; 8 -4.293,-2.8; 17 4.293,-2.8; 18 4.293,-2; 19 4.293,-1.2; 20 4.293,-0.4; 21 4.293,0.4; 22 4.293,1.2; 23 4.293,2; 24 4.293,2.8 | smd 0.559 x 1.27: 9 -2.8,-4.293; 10 -2,-4.293; 11 -1.2,-4.293; 12 -0.4,-4.293; 13 0.4,-4.293; 14 1.2,-4.293; 15 2,-4.293; 16 2.8,-4.293; 25 2.8,4.293; 26 2,4.293; 27 1.2,4.293; 28 0.4,4.293; 29 -0.4,4.293; 30 -1.2,4.293; 31 -2,4.293; 32 -2.8,4.293
APDS-9960 = smd 0.6 x 0.72: 1 0.7,1.455; 2 0.7,0.485; 3 0.7,-0.485; 4 0.7,-1.455; 5 -0.7,-1.455; 6 -0.7,-0.485; 7 -0.7,0.485; 8 -0.7,1.455
SOT230P700X180-4N = smd 2.15 x 1: 1 -2.9,2.3; 2 -2.9,0; 3 -2.9,-2.3 | smd 2.15 x 3.25: 4 2.9,0
XTAL_ECS-160-20-3X-TR = smd 3.5 x 1.2: 1 -2.75,0; 2 2.75,0

### Placement (x,y rotation side)
C1  43.33,31.04 270 top
C3  17.42,26.16 180 top
C5  14.73,39.98 180 top
C6  22.66,37.9 90 top
C7  43.59,23.52 90 top
C8  45.77,23.52 90 top
C9  21.64,27.99 270 top
C10  21.64,33.07 270 top
C11  18.69,42.01 270 top
C12  23.27,45.06 180 top
C26  28.7,31.85 90 top
C28  30.76,31.85 90 top
CR1  11.33,42.82 180 top
IC1  21.84,41.66 270 top
J1  4.88,45.39 270 top
J2  6.63,34.98 270 top
J9  18.85,47.93 180 top
JP1  18.08,22.86 0 top
LED1  36.88,5.13 180 top
LED2  17.83,5.13 0 top
LED3  37.74,45.36 270 top
LED4  27.08,45.34 270 top
LED5  10.21,5.13 180 top
LED6  17.83,12.75 0 top
LED7  10.21,12.75 180 top
LED8  44.5,12.75 0 top
LED9  36.88,12.75 180 top
LED10  44.5,5.13 0 top
M1  55.02,35.86 90 top
Q1  24.18,17.83 270 top
Q2  30.53,17.83 270 top
Q3  38.15,39.42 180 top
Q4  31.93,39.42 180 top
R1  12.04,25.2 90 top
R2  22.91,5.13 180 top
R3  5.13,5.13 0 top
R4  30.15,44.4 180 top
R5  26.09,22.4 180 top
R6  30.53,22.4 0 top
R7  22.91,12.75 180 top
R8  34.75,43.43 180 top
R9  5.13,12.75 0 top
R12  31.8,5.13 0 top
R13  49.58,12.75 180 top
R14  31.8,12.75 0 top
R15  49.58,5.13 180 top
R16  40.69,42.47 0 top
R17  28.88,40.94 90 top
R18  42.47,38.02 0 top
R19  35.1,40.31 90 top
S1  6.02,26.09 180 top
U1  37.01,30.91 0 top
U2  25.2,39.42 0 top
U3  15.34,34.34 270 top
Y2  25.15,30.48 90 top

### Tracks (layer width: path | path; a pad name or v marks a point on that pad's centre or on a via)
3.3V  (via drill 0.35)
  Top 0.483: 39.9,40.53 39.1,40.53 Q3.1 | 39.9,40.53 41.48,42.12 41.48,42.44 R16.2 | C7.2 43.71,24.5 45.77,24.5 C8.2 45.93,24.66 47.68,24.66 48.63,25.61 M1.2 | v40.06,37.99 40.06,40.37 39.9,40.53 | U2.5 24.34,37.83 23.7,37.83 22.75,36.88 C6.1 22.43,37.04 21.32,38.15 21.32,40.06 22.12,40.85 22.12,41.17 23.13,42.18 | 23.39,42.44 23.23,42.6 IC1.5 | 23.39,42.44 23.86,41.96 | 23.86,41.96 24.34,41.48 24.34,41.01 U2.8 | 24.02,42.28 24.02,42.12 23.86,41.96 | 24.02,42.28 24.02,44.94 C12.1 | 23.39,42.44 23.13,42.18 | 24.02,42.28 26.88,42.28 27.04,42.12 28.78,42.12 R17.2 28.94,41.8 31.48,41.8 32.75,40.53 Q4.1 32.59,41.01 v33.23,41.64 | 23.13,42.18 21.13,44.18 18.15,44.18 14.5,47.83 13.86,47.83 J9.3
  Bottom 0.483: M1.2 48.63,25.77 40.06,34.34 v40.06,37.99 39.9,38.15 36.72,38.15 v33.23,41.64
5V
  Top 0.483: R19.2 34.98,41.33 33.86,42.44 33.86,43.39 R8.2 33.71,43.55 33.71,44.82 | 33.71,44.82 30.69,47.83 18.94,47.83 J9.1 18.62,47.99 17.35,49.26 10.69,49.26 9.42,47.99 6.24,47.99 J1.2 | C28.1 30.69,30.85 31.8,29.74 32.59,29.74 U1.6 32.91,29.74 33.55,29.74 34.34,28.94 41.17,28.94 U1.18 41.48,28.94 44.34,28.94 44.66,29.26 44.66,32.75 43.55,33.86 43.55,37.99 R18.2 43.23,38.15 43.23,43.52 39.24,47.52 36.88,47.52 34.34,44.98 33.86,44.98 33.71,44.82 | U1.4 32.59,31.32 31.8,31.32 31.17,30.69 C28.1 | C28.1 30.53,31.01 28.78,31.01 C26.1 28.47,30.85 15.29,30.85 U3.4 | LED10.A 40.69,5.13 | 40.69,5.13 LED1.A | LED8.A 40.69,12.75 | 40.69,12.75 LED9.A | 40.69,12.75 40.69,5.13 | LED2.A 14.02,5.13 | 14.02,5.13 LED5.A | LED6.A 14.02,12.75 | 14.02,12.75 LED7.A | 14.02,12.75 14.02,5.13 | 14.02,26.24 15.77,26.24 C3.+ 15.13,26.4 15.13,31.32 U3.4 | 14.02,26.24 12.13,26.24 R1.2 | U3.2 15.45,37.2 15.45,31.48 U3.4 | 14.02,26.24 14.02,12.75
  Bottom 0.483: LED1.A 37.2,5.13 36.09,6.24 17.67,6.24 LED2.A
CE
  Top 0.254: U1.11 35.93,26.56 35.93,25.77 40.21,21.48 49.58,21.48 51.17,23.07 M1.3
CSN  (via drill 0.35)
  Top 0.254: v42.12,24.82 37.67,24.82 36.72,25.77 36.72,26.56 U1.12
  Bottom 0.254: v42.12,24.82 47.99,24.82 48.31,24.5 50.06,24.5 51.17,25.61 M1.4
GND  (via drill 0.45)
  Top 0.483: v28.65,19.05 29.58,19.05 Q2.2 | C3.- 20.73,24.49 21.95,24.49 22.55,23.88 v22.55,20.93 22.75,20.93 23.23,20.45 Q1.2 23.23,18.78 | C11.2 19.09,41.06 19.68,41.65 IC1.2 20.7,41.86 21.2,41.86 21.56,42.21 v21.74,42.21 | U1.3 32.79,32.04 33.53,32.04 33.79,31.78 33.79,31.08 34.29,30.58 | U1.5 34.22,30.51 34.29,30.58 | U1.21 41.22,31.24 40.48,31.24 39.83,30.58 34.29,30.58 | v20.78,45.16 22.21,45.16 C12.2 | C26.2 28.35,33.16 v28.35,34.7 | v23.42,34.85 22.47,34.85 C10.1
  Bottom 0.483: v28.65,19.05 27.33,20.37 23.11,20.37 v22.55,20.93 | v21.74,42.21 20.78,43.18 v20.78,45.16 | v28.35,34.7 23.57,34.7 v23.42,34.85
  other vias: 19.35,39.22 14.12,34.75
  pour Top: 0.71,52.17 38.66,52.17 47.14,43.69 64.82,43.69 64.82,-0.1 0.05,-0.1 0.05,52.17
  pour Bottom: 4.01,0.15 65.02,0.15 65.07,0.2 65.07,43.69 47.29,43.69 40.13,50.85 39.98,50.85 0.56,50.85 0.41,51 0.41,0.51 0.76,0.15
IRQ  (via drill 0.45)
  Top 0.254: v35.36,31.55 34.21,32.7 U1.32
  Bottom 0.254: M1.8 56.41,25.61 57.52,24.5 57.52,22.75 55.77,21.01 43.23,21.01 43.23,21.95 40.14,25.04 40.14,26.76 v35.36,31.55
MCU_RESET  (via drill 0.35)
  Top 0.254: v36.56,33.86 36.56,35.13 U1.29 | R1.1 11.98,24.18 9.73,24.18 9.42,23.86 S1.1
  Bottom 0.254: v36.56,33.86 34.68,35.74 21.3,35.74 16.32,30.77 | 16.32,30.77 9.42,23.86 S1.1 | 16.32,30.77 4.34,42.75 3.7,42.75 J1.5
MCU_RX0  (via drill 0.35)
  Top 0.254: v26.4,32.75 26.4,36.25 35.45,36.25 35.77,35.93 35.77,35.29 U1.30
  Bottom 0.254: v26.4,32.75 16.88,23.23 16.88,22.91 JP1.1
MCU_TX0  (via drill 0.35)
  Top 0.254: v34.98,33.07 34.98,35.13 U1.31
  Bottom 0.254: v34.98,33.07 33.07,33.07 22.91,22.91 19.42,22.91 JP1.2
MISO  (via drill 0.35)
  Top 0.254: v40.85,25.61 39.9,26.56 U1.16
  Bottom 0.254: M1.7 56.25,23.07 55.14,21.96 43.87,21.96 40.85,24.97 v40.85,25.61 40.85,30.69 25.62,45.92 20.46,45.92 18.57,44.02 5.77,44.02 4.97,44.82 4.97,45.77 3.7,47.04 3.7,47.83 J1.1
MOSI  (via drill 0.35)
  Top 0.254: v50.37,27.04 40.85,27.04 40.21,27.67 39.42,27.67 39.1,27.36 39.1,26.72 U1.15
  Bottom 0.254: 52.12,27.04 52.44,27.04 53.71,25.77 M1.6 | 52.12,27.04 v50.37,27.04 | J1.4 7.13,46.38 29.88,46.38 30.86,45.39 33.77,45.39 52.12,27.04
N$2
  Top 0.483: LED2.K R2.2
N$3
  Top 0.483: LED5.K R3.2
N$4
  Top 0.254: U1.20 41.33,30.37 43.07,30.37 43.23,30.21 C1.2
N$5
  Top 0.483: LED6.K R7.2
N$6
  Top 0.254: U1.9 34.18,26.56 31.17,26.56 27.04,22.43 R5.1
N$7
  Top 0.483: LED7.K R9.2
N$8
  Top 0.254: LED4.A 27.2,44.34 29.1,44.34 R4.2
N$10
  Top 0.254: Q2.1 31.5,19.15 31.5,22.39 R6.2
N$11
  Top 0.254: U1.10 34.98,26.56 34.98,25.93 32.59,23.55 30.69,23.55 29.58,22.43 R6.1
N$12
  Top 0.254: LED3.A 37.67,44.18 36.4,44.18 35.77,43.55 R8.1
N$13
  Top 0.254: R5.2 25.08,22.35 25.08,19.18 Q1.1
N$14
  Top 0.254: U1.8 32.59,27.99 25.45,27.99 25.29,27.83 Y2.1 25.13,27.67 24.66,27.2 21.64,27.2 C9.2
N$15  (via drill 0.35)
  Top 0.254: v27.36,29.9 28.31,28.94 32.59,28.94 U1.7 | v27.04,31.96 26.09,31.96 25.29,32.75 25.29,33.23 Y2.2 25.61,32.28 21.64,32.28 C10.2
  Bottom 0.254: v27.36,29.9 27.36,31.64 v27.04,31.96
N$24
  Top 0.254: U2.4 25.93,37.99 25.93,38.79 U2.3
N$26
  Top 0.483: LED1.K R12.2
N$27
  Top 0.483: LED8.K R13.2
N$28
  Top 0.483: LED9.K R14.2
N$29
  Top 0.483: LED10.K R15.2
N$30
  Top 0.483: 4.18,6.4 R9.1 | 4.18,6.4 R3.1 | 23.86,12.59 R2.1 23.86,4.97 22.75,3.86 11.16,3.86 10.37,4.65 10.37,5.29 9.26,6.4 4.18,6.4 | 23.86,12.59 R7.1 | Q1.3 24.18,14.97 23.86,14.65 23.86,12.59
N$31
  Top 0.483: 50.53,11.48 R13.1 | 50.53,11.48 R15.1 | R12.1 R14.1 30.48,13.12 30.48,14.88 | 50.53,11.48 45.45,11.48 44.34,12.59 44.34,13.23 43.55,14.02 31.34,14.02 30.48,14.88 | Q2.3 30.48,16.48 30.48,14.88
N$33
  Top 0.762: CR1.2 9.42,42.75 8.78,42.75 6.24,40.21 6.24,37.52 J2.2
SCK  (via drill 0.35)
  Top 0.254: U1.17 41.33,27.99 50.53,27.99 52.6,25.93 52.6,24.34 53.71,23.23 M1.5 | R4.1 31.06,44.43 v31.06,46.19
  Bottom 0.254: M1.5 53.87,23.23 54.98,24.34 54.98,26.09 34.87,46.19 v31.06,46.19 27.74,49.51 3,49.51 2.43,48.95 2.43,46.88 3.54,45.77 3.54,45.45 J1.3
SCL_3V
  Top 0.254: 27.91,40.29 28.15,40.06 28.78,40.06 R17.1 | 27.91,40.29 26.56,41.64 25.45,41.64 25.13,41.33 25.13,40.37 24.82,40.06 24.5,40.06 U2.7 | Q4.2 30.85,40.37 27.99,40.37 27.91,40.29
SCL_5V  (via drill 0.35)
  Top 0.254: v36.4,36.88 37.36,35.93 37.36,35.29 U1.28 | 35.29,38.47 35.29,39.1 35.13,39.26 R19.1 | 35.29,38.47 v35.29,37.99 | 35.29,38.47 31.96,38.47 Q4.3
  Bottom 0.254: v35.29,37.99 v36.4,36.88
SDA_3V
  Top 0.254: U2.1 25.93,40.85 26.09,40.85 29.74,37.2 35.61,37.2 37.2,38.79 37.2,40.37 Q3.2 37.36,40.53 39.26,42.44 39.74,42.44 R16.1
SDA_5V
  Top 0.254: Q3.3 38.15,37.2 | 38.15,37.2 38.15,35.29 U1.27 | 38.15,37.2 40.37,37.2 41.17,37.99 41.48,37.99 R18.1
VIN
  Top 0.483: U3.3 13.11,37.31 C5.+ 14.33,41.2 14.33,42.06 14.18,42.21 13.8,42.21 CR1.1 13.32,42.96 C11.1 19.91,42.96 20.27,42.61 IC1.1

### Text on the board
tPlace: G | 3.3V | G | 5V | NoConflict V2 | ISP | 13 | PWR | + | VIN | - | Reset | Rx | Tx | Clear | Busy | powered by magik :) | C:/Users/aaron/Downloads/download.bmp